# EAGLE design OutputIndicator_20_pins_v1p0 (EAGLE 9.6.2)
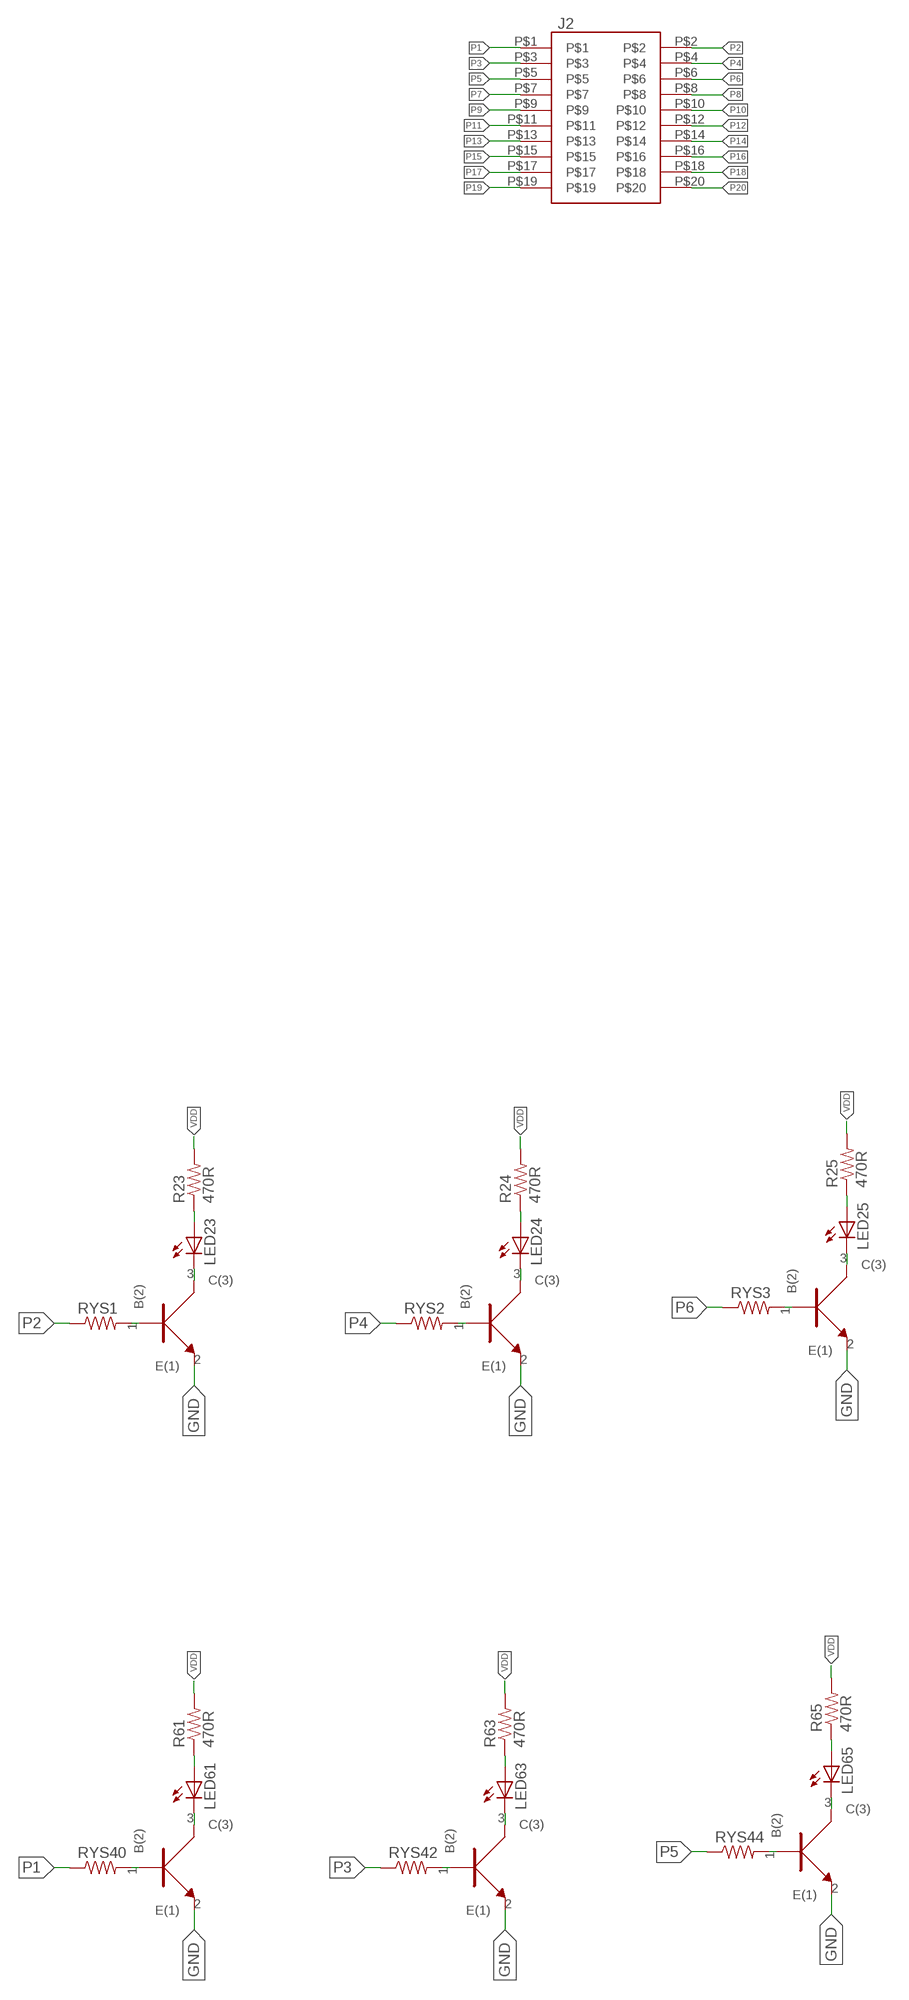
[diagram p0: schematic, sheet 1, part 1 of 2]
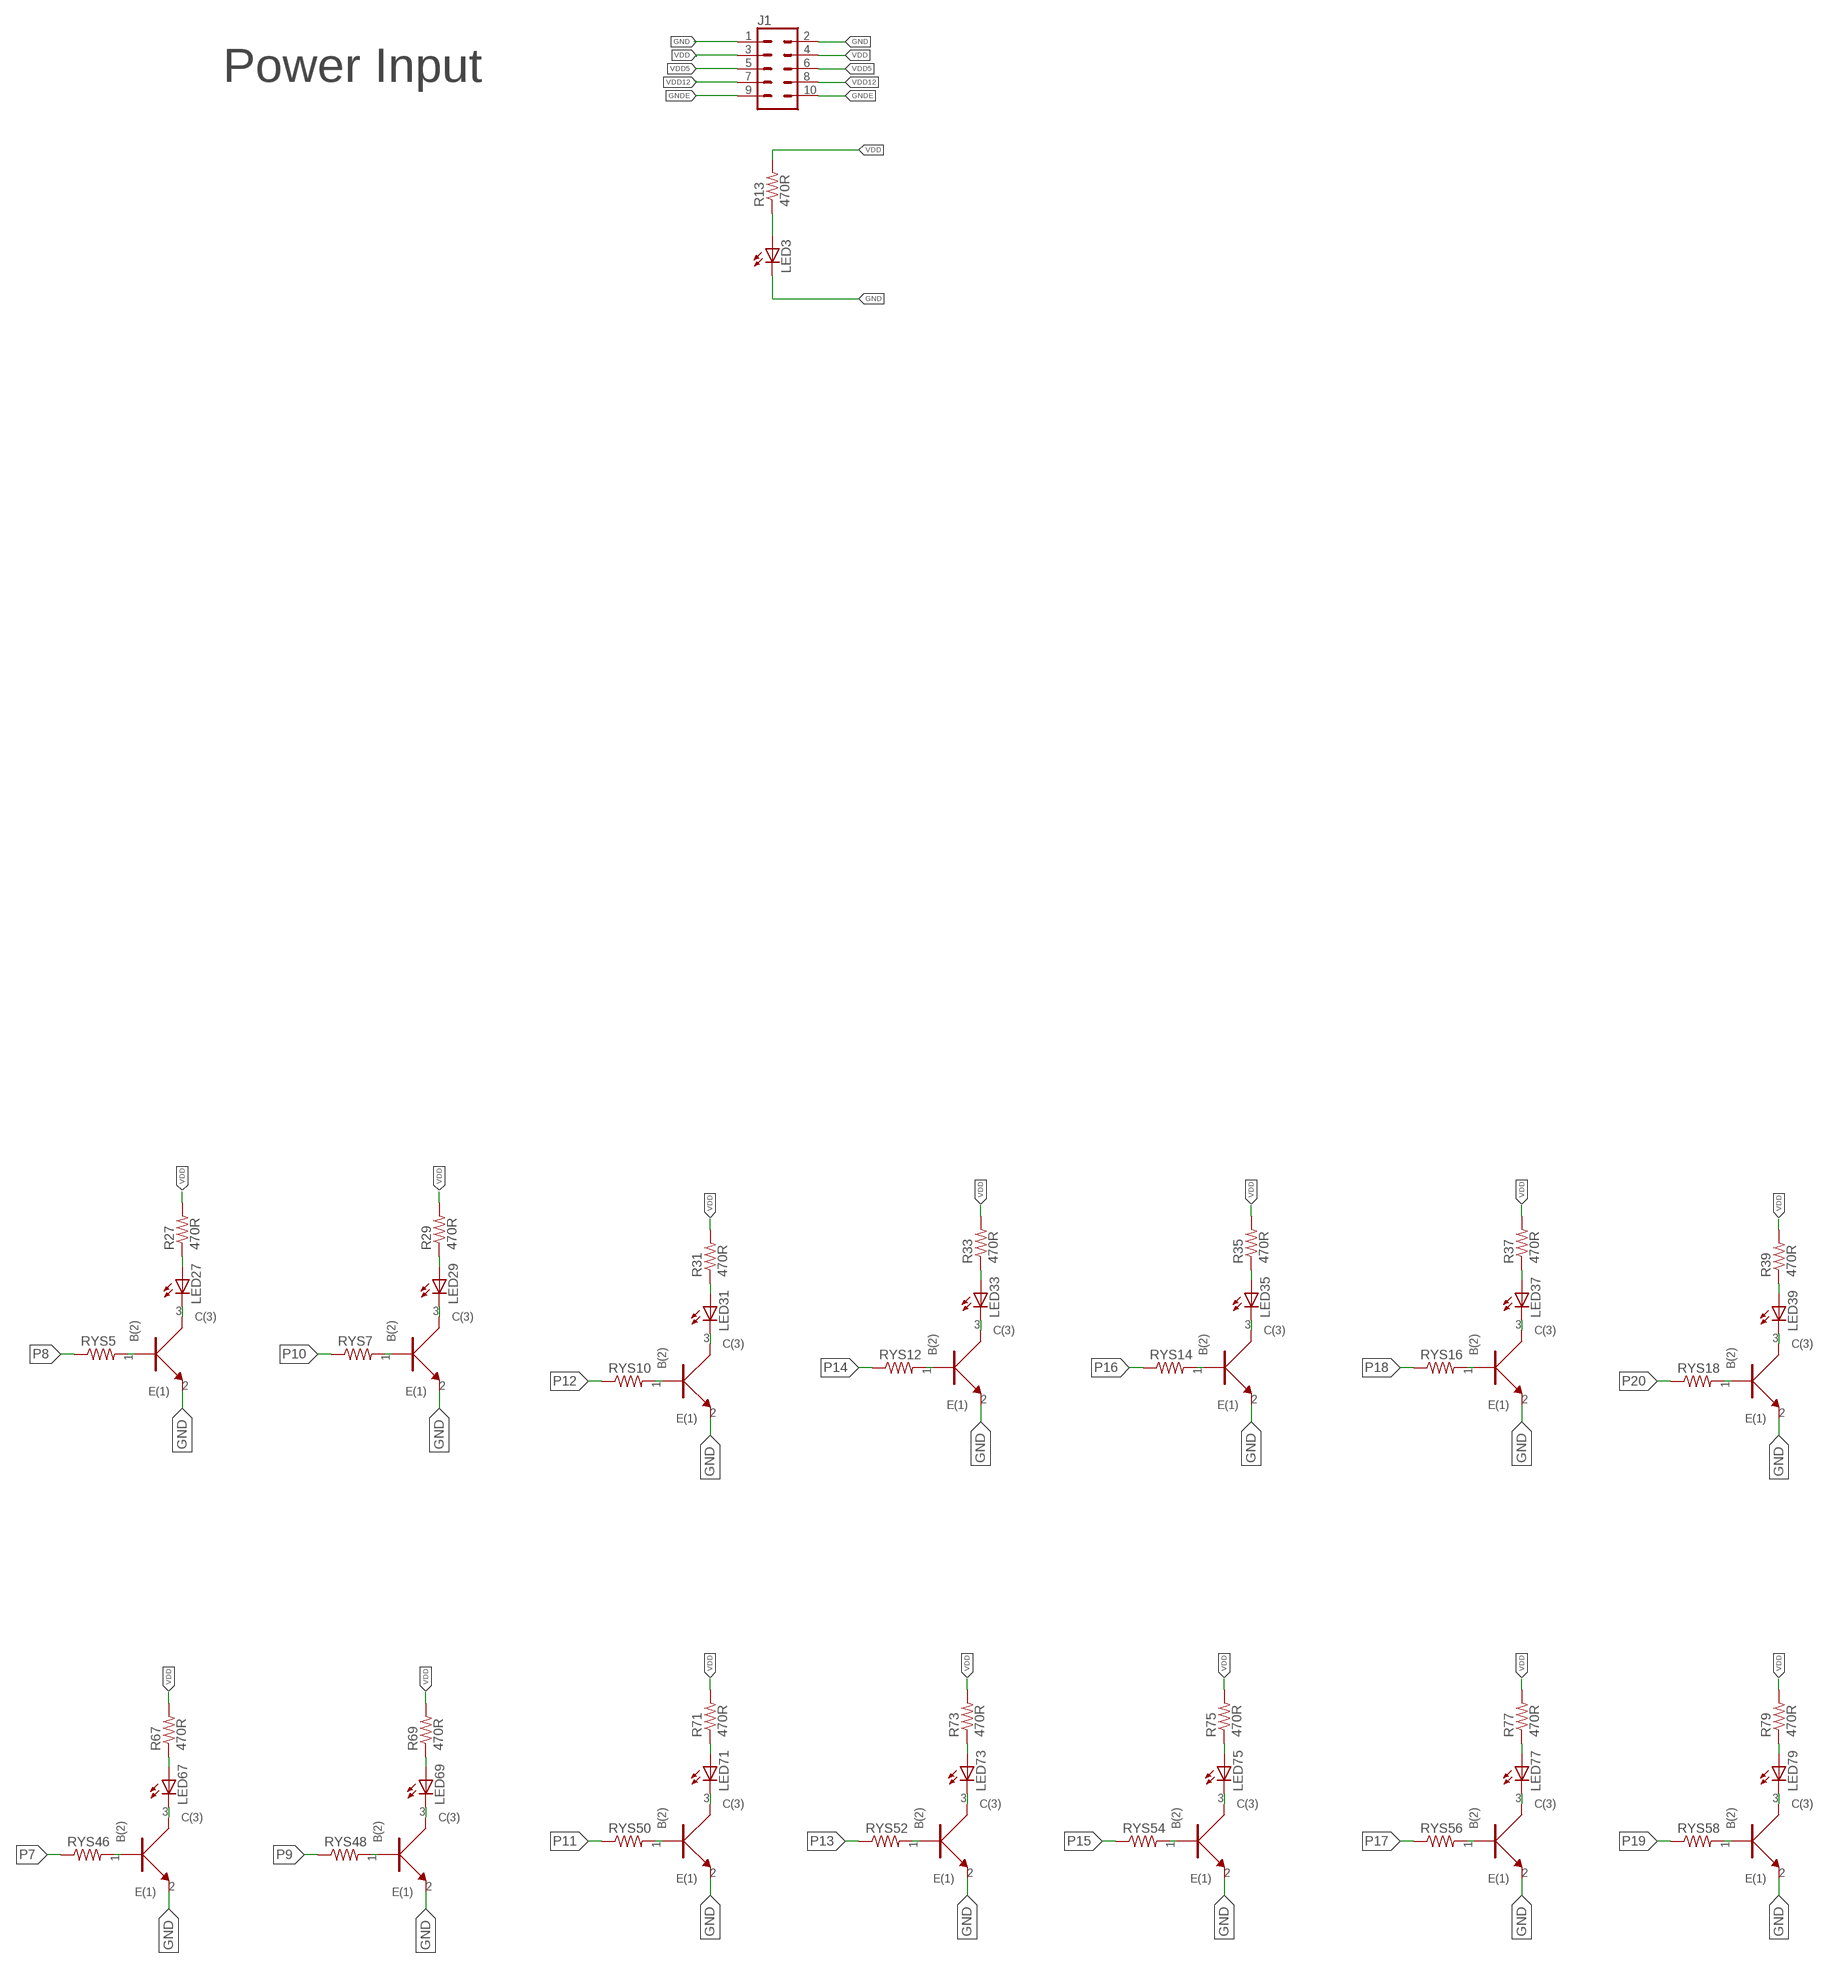
[diagram p1: schematic, sheet 1, part 2 of 2]

## Parts
J1  CONN_05X2PTH  [2X5]
J2  2_X_10_HEADER_GENERIC  [2_X_10_.1_INCH]
LED3  LED_0805_GREEN  [LED_0805_GREEN]
LED23  LED_0805_GREEN  [LED_0805_GREEN]
LED24  LED_0805_GREEN  [LED_0805_GREEN]
LED25  LED_0805_GREEN  [LED_0805_GREEN]
LED27  LED_0805_GREEN  [LED_0805_GREEN]
LED29  LED_0805_GREEN  [LED_0805_GREEN]
LED31  LED_0805_GREEN  [LED_0805_GREEN]
LED33  LED_0805_GREEN  [LED_0805_GREEN]
LED35  LED_0805_GREEN  [LED_0805_GREEN]
LED37  LED_0805_GREEN  [LED_0805_GREEN]
LED39  LED_0805_GREEN  [LED_0805_GREEN]
LED61  LED_0805_GREEN  [LED_0805_GREEN]
LED63  LED_0805_GREEN  [LED_0805_GREEN]
LED65  LED_0805_GREEN  [LED_0805_GREEN]
LED67  LED_0805_GREEN  [LED_0805_GREEN]
LED69  LED_0805_GREEN  [LED_0805_GREEN]
LED71  LED_0805_GREEN  [LED_0805_GREEN]
LED73  LED_0805_GREEN  [LED_0805_GREEN]
LED75  LED_0805_GREEN  [LED_0805_GREEN]
LED77  LED_0805_GREEN  [LED_0805_GREEN]
LED79  LED_0805_GREEN  [LED_0805_GREEN]
R13  470R  R_0402  [0402]
R23  470R  R_0402  [0402]
R24  470R  R_0402  [0402]
R25  470R  R_0402  [0402]
R27  470R  R_0402  [0402]
R29  470R  R_0402  [0402]
R31  470R  R_0402  [0402]
R33  470R  R_0402  [0402]
R35  470R  R_0402  [0402]
R37  470R  R_0402  [0402]
R39  470R  R_0402  [0402]
R61  470R  R_0402  [0402]
R63  470R  R_0402  [0402]
R65  470R  R_0402  [0402]
R67  470R  R_0402  [0402]
R69  470R  R_0402  [0402]
R71  470R  R_0402  [0402]
R73  470R  R_0402  [0402]
R75  470R  R_0402  [0402]
R77  470R  R_0402  [0402]
R79  470R  R_0402  [0402]
RYS1  1K  R_0402  [0402]
RYS2  1K  R_0402  [0402]
RYS3  1K  R_0402  [0402]
RYS5  1K  R_0402  [0402]
RYS7  1K  R_0402  [0402]
RYS10  1K  R_0402  [0402]
RYS12  1K  R_0402  [0402]
RYS14  1K  R_0402  [0402]
RYS16  1K  R_0402  [0402]
RYS18  1K  R_0402  [0402]
RYS40  1K  R_0402  [0402]
RYS42  1K  R_0402  [0402]
RYS44  1K  R_0402  [0402]
RYS46  1K  R_0402  [0402]
RYS48  1K  R_0402  [0402]
RYS50  1K  R_0402  [0402]
RYS52  1K  R_0402  [0402]
RYS54  1K  R_0402  [0402]
RYS56  1K  R_0402  [0402]
RYS58  1K  R_0402  [0402]
U1  BC846BW  [SOT323]
U2  BC846BW  [SOT323]
U3  BC846BW  [SOT323]
U5  BC846BW  [SOT323]
U7  BC846BW  [SOT323]
U9  BC846BW  [SOT323]
U11  BC846BW  [SOT323]
U13  BC846BW  [SOT323]
U15  BC846BW  [SOT323]
U17  BC846BW  [SOT323]
U40  BC846BW  [SOT323]
U42  BC846BW  [SOT323]
U44  BC846BW  [SOT323]
U46  BC846BW  [SOT323]
U48  BC846BW  [SOT323]
U50  BC846BW  [SOT323]
U52  BC846BW  [SOT323]
U54  BC846BW  [SOT323]
U56  BC846BW  [SOT323]
U58  BC846BW  [SOT323]

## Nets
GND: J1.1 J1.2 LED3.C U1.2(E(1)) U2.2(E(1)) U3.2(E(1)) U5.2(E(1)) U7.2(E(1)) U9.2(E(1)) U11.2(E(1)) U13.2(E(1)) U15.2(E(1)) U17.2(E(1)) U40.2(E(1)) U42.2(E(1)) U44.2(E(1)) U46.2(E(1)) U48.2(E(1)) U50.2(E(1)) U52.2(E(1)) U54.2(E(1)) U56.2(E(1)) U58.2(E(1))
GNDE: J1.9 J1.10
N$3: LED3.A R13.P$1
N$45: RYS1.P$2 U1.1(B(2))
N$46: LED23.A R23.P$1
N$47: LED23.C U1.3(C(3))
N$48: RYS2.P$2 U2.1(B(2))
N$49: LED24.A R24.P$1
N$50: LED24.C U2.3(C(3))
N$51: RYS3.P$2 U3.1(B(2))
N$52: LED25.A R25.P$1
N$53: LED25.C U3.3(C(3))
N$57: RYS5.P$2 U5.1(B(2))
N$58: LED27.A R27.P$1
N$59: LED27.C U5.3(C(3))
N$63: RYS7.P$2 U7.1(B(2))
N$64: LED29.A R29.P$1
N$65: LED29.C U7.3(C(3))
N$69: RYS10.P$2 U9.1(B(2))
N$70: LED31.A R31.P$1
N$71: LED31.C U9.3(C(3))
N$75: RYS12.P$2 U11.1(B(2))
N$76: LED33.A R33.P$1
N$77: LED33.C U11.3(C(3))
N$81: RYS14.P$2 U13.1(B(2))
N$82: LED35.A R35.P$1
N$83: LED35.C U13.3(C(3))
N$87: RYS16.P$2 U15.1(B(2))
N$88: LED37.A R37.P$1
N$89: LED37.C U15.3(C(3))
N$93: RYS18.P$2 U17.1(B(2))
N$94: LED39.A R39.P$1
N$95: LED39.C U17.3(C(3))
N$159: RYS40.P$2 U40.1(B(2))
N$160: LED61.A R61.P$1
N$161: LED61.C U40.3(C(3))
N$165: RYS42.P$2 U42.1(B(2))
N$166: LED63.A R63.P$1
N$167: LED63.C U42.3(C(3))
N$171: RYS44.P$2 U44.1(B(2))
N$172: LED65.A R65.P$1
N$173: LED65.C U44.3(C(3))
N$177: RYS46.P$2 U46.1(B(2))
N$178: LED67.A R67.P$1
N$179: LED67.C U46.3(C(3))
N$183: RYS48.P$2 U48.1(B(2))
N$184: LED69.A R69.P$1
N$185: LED69.C U48.3(C(3))
N$189: RYS50.P$2 U50.1(B(2))
N$190: LED71.A R71.P$1
N$191: LED71.C U50.3(C(3))
N$195: RYS52.P$2 U52.1(B(2))
N$196: LED73.A R73.P$1
N$197: LED73.C U52.3(C(3))
N$201: RYS54.P$2 U54.1(B(2))
N$202: LED75.A R75.P$1
N$203: LED75.C U54.3(C(3))
N$207: RYS56.P$2 U56.1(B(2))
N$208: LED77.A R77.P$1
N$209: LED77.C U56.3(C(3))
N$213: RYS58.P$2 U58.1(B(2))
N$214: LED79.A R79.P$1
N$215: LED79.C U58.3(C(3))
P1: J2.P$1 RYS40.P$1
P2: J2.P$2 RYS1.P$1
P3: J2.P$3 RYS42.P$1
P4: J2.P$4 RYS2.P$1
P5: J2.P$5 RYS44.P$1
P6: J2.P$6 RYS3.P$1
P7: J2.P$7 RYS46.P$1
P8: J2.P$8 RYS5.P$1
P9: J2.P$9 RYS48.P$1
P10: J2.P$10 RYS7.P$1
P11: J2.P$11 RYS50.P$1
P12: J2.P$12 RYS10.P$1
P13: J2.P$13 RYS52.P$1
P14: J2.P$14 RYS12.P$1
P15: J2.P$15 RYS54.P$1
P16: J2.P$16 RYS14.P$1
P17: J2.P$17 RYS56.P$1
P18: J2.P$18 RYS16.P$1
P19: J2.P$19 RYS58.P$1
P20: J2.P$20 RYS18.P$1
VDD: J1.3 J1.4 R13.P$2 R23.P$2 R24.P$2 R25.P$2 R27.P$2 R29.P$2 R31.P$2 R33.P$2 R35.P$2 R37.P$2 R39.P$2 R61.P$2 R63.P$2 R65.P$2 R67.P$2 R69.P$2 R71.P$2 R73.P$2 R75.P$2 R77.P$2 R79.P$2
VDD5: J1.5 J1.6
VDD12: J1.7 J1.8

## Notes on the sheet
- Power Input

## Library data of the parts
J1 = 3D_MIG_Controller:CONN_05X2: Multi connection point. Often used as Generic Header-pin footprint for 0.1 inch spaced/style header connections For AVR SPI programming port, see special device with nice symbol: "AVR_SPI_PROG_5x2.dev" You can populate with any combo of single row headers, but if you'd like an exact match, check these: 2x5 AVR ICSP Male Header <https://www.sparkfun.com/products/778> (PRT-00778) 2x5 Pin Shrouded Header <https://www.sparkfun.com/products/8506> (PRT-08506) On any of the 0.1 inch spaced packages, you can populate with these: Break Away Headers - Straight <https://www.sparkfun.com/products/116> (PRT-00116) Break Away Male Headers - Right Angle <https://www.sparkfun.com/products/553> (PRT-00553) Female Headers <https://www.sparkfun.com/products/115> (PRT-00115) Break Away Headers - Machine Pin <https://www.sparkfun.com/products/117> (PRT-00117) Break Away Female Headers - Swiss Machine Pin <https://www.sparkfun.com/products/743> (PRT-00743) Special note: the shrouded connector mates well with our 5x2 ribbon cables: 2x5 Pin IDC Ribbon Cable <https://www.sparkfun.com/products/8535> (PRT-08535); PROD_ID: CONN-08499; SF_ID: PRT-0778
J2 = 3D_MIG_Controller:2_X_10_HEADER_GENERIC: CONN HEADER R/A 20POS 2.54MM, Straight, Right Angle; PARTNO: 67996-420HLF
LED3 LED23-LED25 LED27 LED29 LED31 LED33 LED35 LED37 LED39 LED61 LED63 LED65 LED67 LED69 LED71 LED73 LED75 LED77 LED79 = 3D_MIG_Controller:LED_0805_GREEN
R13 R23-R25 R27 R29 R31 R33 R35 R37 R39 R61 R63 R65 R67 R69 R71 R73 R75 R77 R79 RYS1-RYS3 RYS5 RYS7 RYS10 RYS12 RYS14 RYS16 RYS18 RYS40 RYS42 RYS44 RYS46 RYS48 RYS50 RYS52 RYS54 RYS56 RYS58 = 3D_MIG_Controller:R_0402
U1-U3 U5 U7 U9 U11 U13 U15 U17 U40 U42 U44 U46 U48 U50 U52 U54 U56 U58 = 3D_MIG_Controller:BC846BW; MANUFACTURER_PART_NUMBER: BC846BW; VENDOR: Nexperia

## Board
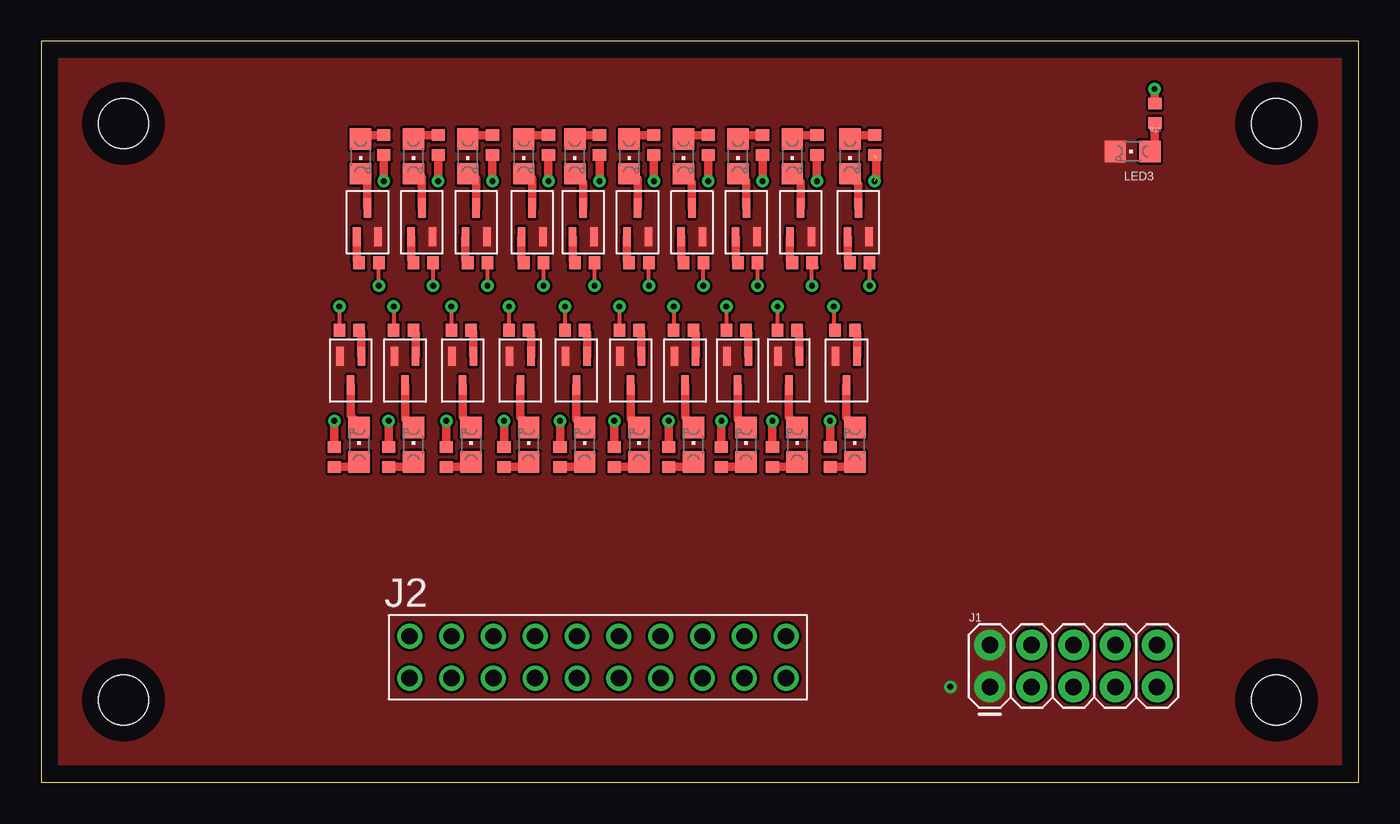
[diagram p2: board, top side]
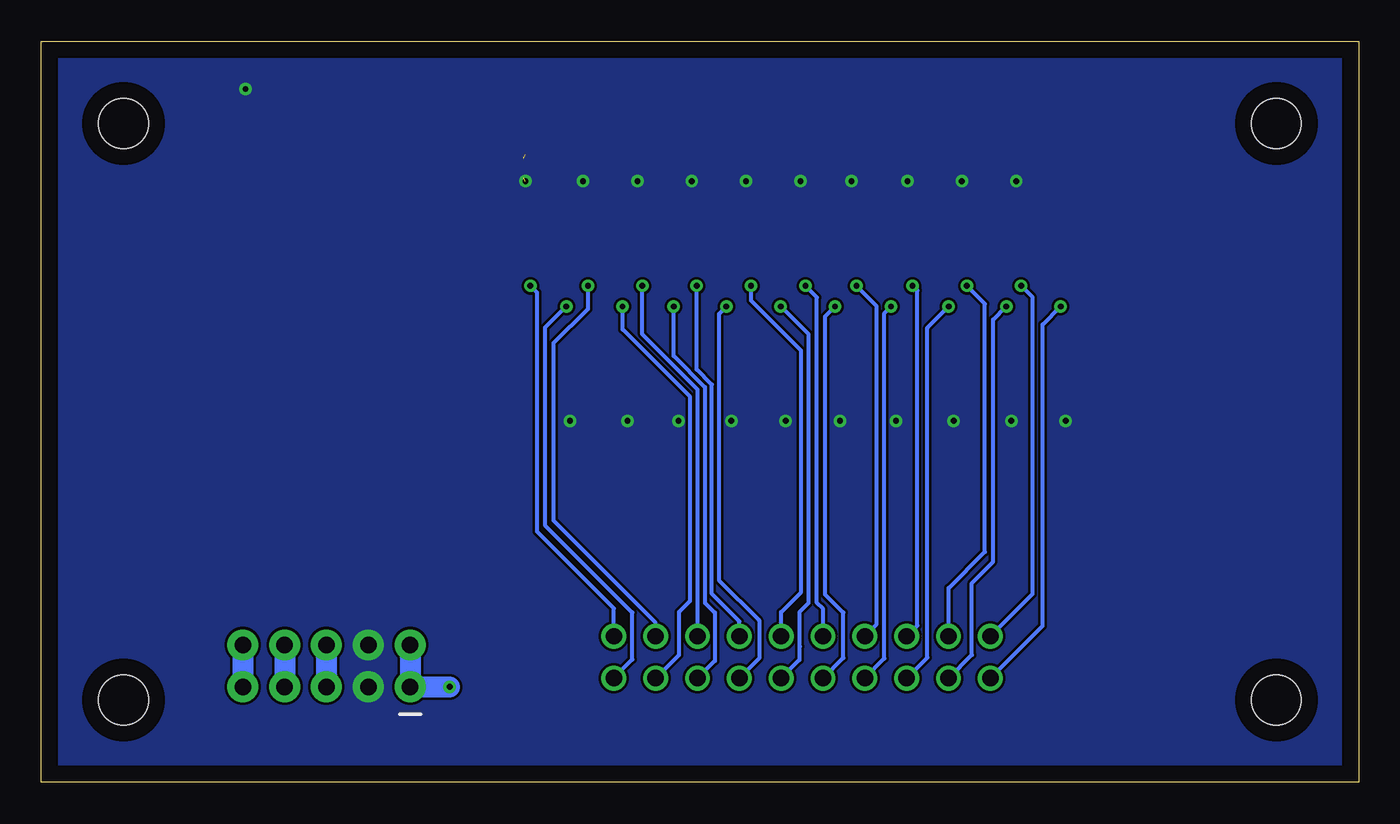
[diagram p3: board, bottom side, seen from below]

Size 80 x 45 mm. Coordinates in mm from the lower left corner, seen from the top.
Outline: 0,0 80,0 80,45 0,45 0,0
Copper layers (1*16): Top 0.035mm / dielectric 1.5mm / Bottom 0.035mm
Design rules "default": minimum track width 6mil, minimum drill 0.35mm, track to track 6mil, track to pad 6mil, pad to pad 6mil, via to via 6mil, smd to smd 6mil, copper to edge 40mil, drill to drill 6mil, minimum pad ring 10mil, minimum via ring 8mil, stop-mask expansion 4mil, vias tented up to drill 0mil, thermal gap 10mil
Holes 3 mm at 5,5 75,5 5,40 75,40

### Footprints (pad centres in the part's own frame; a part is rotated, then mirrored left to right if it is on the bottom)
2X5 = drill 1 pad 1.88: 1 0,0; 2 0,2.54; 3 2.54,0; 4 2.54,2.54; 5 5.08,0; 6 5.08,2.54; 7 7.62,0; 8 7.62,2.54; 9 10.16,0; 10 10.16,2.54
2_X_10_.1_INCH = drill 1: P$1 -11.43,-1.27; P$2 -11.43,1.27; P$3 -8.89,-1.27; P$4 -8.89,1.27; P$5 -6.35,-1.27; P$6 -6.35,1.27; P$7 -3.81,-1.27; P$8 -3.81,1.27; P$9 -1.27,-1.27; P$10 -1.27,1.27; P$11 1.27,-1.27; P$12 1.27,1.27; P$13 3.81,-1.27; P$14 3.81,1.27; P$15 6.35,-1.27; P$16 6.35,1.27; P$17 8.89,-1.27; P$18 8.89,1.27; P$19 11.43,-1.27; P$20 11.43,1.27
LED_0805_GREEN = smd 1.3 x 1.3: A 0,-1.05; C 0,1.05
0402 = smd 0.8 x 0.7: P$1 0,0.6; P$2 0,-0.6
SOT323 = smd 0.457 x 1.168: 1 -0.65,-0.876; 2 0.65,-0.876; 3 0,0.876

### Placement (x,y rotation side)
J1  57.6,5.8 0 top
J2  33.8,7.6 0 top
LED3  66.26,38.31 90 top
LED23  19.4,38 180 top
LED24  22.6,38 180 top
LED25  25.9,38 180 top
LED27  29.3,38 180 top
LED29  32.4,38 180 top
LED31  35.7,38 180 top
LED33  39,38 180 top
LED35  42.3,38 180 top
LED37  45.6,38 180 top
LED39  49.1,38 180 top
LED61  19.3,20.5 0 top
LED63  22.6,20.5 0 top
LED65  26.1,20.5 0 top
LED67  29.6,20.5 0 top
LED69  33,20.5 0 top
LED71  36.3,20.5 0 top
LED73  39.6,20.5 0 top
LED75  42.8,20.5 0 top
LED77  45.9,20.5 0 top
LED79  49.4,20.5 0 top
R13  67.62,40.63 180 top
R23  20.8,38.7 0 top
R24  24.1,38.7 0 top
R25  27.4,38.7 0 top
R27  30.8,38.7 0 top
R29  33.9,38.7 0 top
R31  37.2,38.7 0 top
R33  40.5,38.7 0 top
R35  43.8,38.7 0 top
R37  47.1,38.7 0 top
R39  50.6,38.7 0 top
R61  17.8,19.75 180 top
R63  21.1,19.75 180 top
R65  24.6,19.75 180 top
R67  28.1,19.75 180 top
R69  31.5,19.75 180 top
R71  34.8,19.75 180 top
R73  38.1,19.75 180 top
R75  41.3,19.75 180 top
R77  44.4,19.75 180 top
R79  47.9,19.75 180 top
RYS1  19.9,31.55 270 top
RYS2  23.2,31.55 270 top
RYS3  26.5,31.55 270 top
RYS5  29.9,31.55 270 top
RYS7  33,31.55 270 top
RYS10  36.3,31.55 270 top
RYS12  39.6,31.55 270 top
RYS14  42.9,31.55 270 top
RYS16  46.2,31.55 270 top
RYS18  49.7,31.55 270 top
RYS40  18.7,27.45 90 top
RYS42  22,27.45 90 top
RYS44  25.5,27.45 90 top
RYS46  29,27.45 90 top
RYS48  32.4,27.45 90 top
RYS50  35.7,27.45 90 top
RYS52  39,27.45 90 top
RYS54  42.2,27.45 90 top
RYS56  45.3,27.45 90 top
RYS58  48.8,27.45 90 top
U1  19.81,34 0 top
U2  23.11,34 0 top
U3  26.41,34 0 top
U5  29.81,34 0 top
U7  32.91,34 0 top
U9  36.21,34 0 top
U11  39.51,34 0 top
U13  42.81,34 0 top
U15  46.11,34 0 top
U17  49.61,34 0 top
U40  18.79,25 180 top
U42  22.09,25 180 top
U44  25.59,25 180 top
U46  29.09,25 180 top
U48  32.49,25 180 top
U50  35.79,25 180 top
U52  39.09,25 180 top
U54  42.29,25 180 top
U56  45.39,25 180 top
U58  48.89,25 180 top

### Tracks (layer width: path | path; a pad name or v marks a point on that pad's centre or on a via)
GND  (via drill 0.35)
  Bottom 1.27: J1.2 J1.1 v55.2,5.8
  pour Top (no thermals): 0,0 0,45 80,45 80,0
GNDE
  Bottom 1.27: J1.10 J1.9
N$3
  Top 0.508: R13.P$1 67.62,38.42 LED3.A
N$45
  Top 0.254: 19.16,31.51 RYS1.P$2
  Top 0.508: U1.1 19.16,31.69 RYS1.P$2
N$46
  Top 0.152: R23.P$1 20.56,39.45
  Top 0.508: R23.P$1 19.84,39.3 LED23.A
N$47
  Top 0.254: LED23.C 19.38,37.17 19.38,37.27
  Top 0.508: U1.3 19.81,36.84 19.38,37.27
N$48
  Top 0.254: 22.46,31.51 RYS2.P$2
  Top 0.508: U2.1 22.46,31.69 RYS2.P$2
N$49
  Top 0.152: R24.P$1 23.86,39.35
  Top 0.508: R24.P$1 22.84,39.3 LED24.A
N$50
  Top 0.254: 22.68,37.17 LED24.C
  Top 0.508: U2.3 23.11,36.74 22.68,37.17
N$51
  Top 0.254: 25.76,31.51 RYS3.P$2
  Top 0.508: U3.1 25.76,31.69 RYS3.P$2
N$52
  Top 0.152: R25.P$1 27.16,39.25
  Top 0.508: R25.P$1 26.14,39.3 LED25.A
N$53
  Top 0.254: 25.98,37.08 LED25.C
  Top 0.508: U3.3 26.41,36.64 25.98,37.08
N$57
  Top 0.254: 29.16,31.51 RYS5.P$2
  Top 0.508: U5.1 29.16,31.69 RYS5.P$2
N$58
  Top 0.152: R27.P$1 30.56,39.25
  Top 0.508: R27.P$1 29.54,39.3 LED27.A
N$59
  Top 0.254: 29.38,37.08 LED27.C
  Top 0.508: U5.3 29.81,36.64 29.38,37.08
N$63
  Top 0.254: 32.26,31.51 RYS7.P$2
  Top 0.508: U7.1 32.26,31.69 RYS7.P$2
N$64
  Top 0.152: R29.P$1 33.66,39.05
  Top 0.508: R29.P$1 32.64,39.3 LED29.A
N$65
  Top 0.254: 32.48,36.88 LED29.C
  Top 0.508: U7.3 32.91,36.44 32.48,36.88
N$69
  Top 0.254: 35.56,31.51 RYS10.P$2
  Top 0.508: U9.1 35.56,31.69 RYS10.P$2
N$70
  Top 0.152: R31.P$1 36.96,39.25
  Top 0.508: R31.P$1 35.94,39.3 LED31.A
N$71
  Top 0.254: 35.77,37.08 LED31.C
  Top 0.508: U9.3 36.21,36.64 35.77,37.08
N$75
  Top 0.254: 38.86,31.51 RYS12.P$2
  Top 0.508: U11.1 38.86,31.69 RYS12.P$2
N$76
  Top 0.152: R33.P$1 40.26,39.05
  Top 0.508: R33.P$1 39.24,39.3 LED33.A
N$77
  Top 0.254: 39.08,36.88 LED33.C
  Top 0.508: U11.3 39.51,36.44 39.08,36.88
N$81
  Top 0.254: 42.16,31.51 RYS14.P$2
  Top 0.508: U13.1 42.16,31.69 RYS14.P$2
N$82
  Top 0.152: R35.P$1 43.56,39.15
  Top 0.508: R35.P$1 42.54,39.3 LED35.A
N$83
  Top 0.254: 42.38,36.98 LED35.C
  Top 0.508: U13.3 42.81,36.54 42.38,36.98
N$87
  Top 0.254: 45.46,31.51 RYS16.P$2
  Top 0.508: U15.1 45.46,31.69 RYS16.P$2
N$88
  Top 0.152: R37.P$1 46.86,39.05
  Top 0.508: R37.P$1 45.84,39.3 LED37.A
N$89
  Top 0.254: 45.67,36.88 LED37.C
  Top 0.508: U15.3 46.11,36.44 45.67,36.88
N$93
  Top 0.254: 48.96,31.51 RYS18.P$2
  Top 0.508: U17.1 48.96,31.69 RYS18.P$2
N$94
  Top 0.508: R39.P$1 49.34,39.3 LED39.A
N$95
  Top 0.254: 49.17,36.77 LED39.C
  Top 0.508: U17.3 49.61,36.34 49.17,36.77
N$159
  Top 0.254: 19.44,27.49 RYS40.P$2
  Top 0.508: U40.1 19.44,27.31 RYS40.P$2
N$160
  Top 0.152: R61.P$1 18.04,19.39
  Top 0.508: LED61.A 19,19.15 R61.P$1
N$161
  Top 0.254: LED61.C 19.32,21.57 19.32,21.73
  Top 0.508: U40.3 18.79,22.26 19.32,21.73
N$165
  Top 0.254: 22.74,27.49 RYS42.P$2
  Top 0.508: U42.1 22.74,27.31 RYS42.P$2
N$166
  Top 0.152: R63.P$1 21.34,19.39
  Top 0.508: R63.P$1 22.3,19.15 LED63.A
N$167
  Top 0.254: 22.52,21.62 LED63.C
  Top 0.508: U42.3 22.09,22.06 22.52,21.62
N$171
  Top 0.254: 26.24,27.49 RYS44.P$2
  Top 0.508: U44.1 26.24,27.31 RYS44.P$2
N$172
  Top 0.152: R65.P$1 24.84,19.39
  Top 0.508: R65.P$1 25.8,19.15 LED65.A
N$173
  Top 0.254: 26.02,21.73 26.02,21.62 LED65.C
  Top 0.508: U44.3 25.59,22.16 26.02,21.73
N$177
  Top 0.254: 29.74,27.49 RYS46.P$2
  Top 0.508: U46.1 29.74,27.31 RYS46.P$2
N$178
  Top 0.152: R67.P$1 28.34,19.39
  Top 0.508: R67.P$1 29.3,19.15 LED67.A
N$179
  Top 0.254: 29.52,21.73 29.52,21.62 LED67.C
  Top 0.508: U46.3 29.09,22.16 29.52,21.73
N$183
  Top 0.254: 33.14,27.49 RYS48.P$2
  Top 0.508: U48.1 33.14,27.31 RYS48.P$2
N$184
  Top 0.152: R69.P$1 31.74,19.39
  Top 0.508: R69.P$1 32.7,19.15 LED69.A
N$185
  Top 0.254: 32.92,21.62 LED69.C
  Top 0.508: U48.3 32.49,22.06 32.92,21.62
N$189
  Top 0.254: 36.44,27.49 RYS50.P$2
  Top 0.508: U50.1 36.44,27.31 RYS50.P$2
N$190
  Top 0.152: R71.P$1 35.04,19.39
  Top 0.508: R71.P$1 36,19.15 LED71.A
N$191
  Top 0.254: 36.23,21.62 LED71.C
  Top 0.508: U50.3 35.79,22.06 36.23,21.62
N$195
  Top 0.254: 39.74,27.49 RYS52.P$2
  Top 0.508: U52.1 39.74,27.31 RYS52.P$2
N$196
  Top 0.152: R73.P$1 38.34,19.39
  Top 0.508: R73.P$1 39.3,19.15 LED73.A
N$197
  Top 0.254: 39.52,21.73 39.52,21.62 LED73.C
  Top 0.508: U52.3 39.09,22.16 39.52,21.73
N$201
  Top 0.254: 42.94,27.49 RYS54.P$2
  Top 0.508: U54.1 42.94,27.31 RYS54.P$2
N$202
  Top 0.152: R75.P$1 41.54,19.39
  Top 0.508: R75.P$1 42.5,19.15 LED75.A
N$203
  Top 0.254: 42.73,21.62 LED75.C
  Top 0.508: U54.3 42.29,22.06 42.73,21.62
N$207
  Top 0.254: 46.04,27.49 RYS56.P$2
  Top 0.508: U56.1 46.04,27.31 RYS56.P$2
N$208
  Top 0.152: R77.P$1 44.64,19.39
  Top 0.508: R77.P$1 45.6,19.15 LED77.A
N$209
  Top 0.254: 45.83,21.73 45.83,21.62 LED77.C
  Top 0.508: U56.3 45.39,22.16 45.83,21.73
N$213
  Top 0.254: 49.54,27.49 RYS58.P$2
  Top 0.508: U58.1 49.54,27.31 RYS58.P$2
N$214
  Top 0.152: R79.P$1 48.14,19.39
  Top 0.508: R79.P$1 49.1,19.15 LED79.A
N$215
  Top 0.254: 49.33,21.73 49.33,21.62 LED79.C
  Top 0.508: U58.3 48.89,22.16 49.33,21.73
P1  (via drill 0.35)
  Top 0.254: v18.1,28.89 RYS40.P$1
  Bottom 0.254: J2.P$1 19.2,9.5 19.2,27.79 v18.1,28.89
P2  (via drill 0.35)
  Top 0.254: v20.5,30.15 RYS1.P$1
  Bottom 0.254: J2.P$2 19.8,11.44 19.8,29.45 v20.5,30.15
P3  (via drill 0.35)
  Top 0.254: v21.4,28.89 RYS42.P$1
  Bottom 0.254: J2.P$3 23.5,7.74 23.5,12.1 22.2,13.4 22.2,28.09 v21.4,28.89
P4  (via drill 0.35)
  Top 0.254: v23.8,30.15 RYS2.P$1
  Bottom 0.254: J2.P$4 24.91,11.79 22.7,14 22.7,29.05 v23.8,30.15
P5  (via drill 0.35)
  Top 0.254: v24.9,28.89 RYS44.P$1
  Bottom 0.254: J2.P$5 26.2,7.58 26.2,27.59 v24.9,28.89
P6  (via drill 0.35)
  Top 0.254: v27.1,30.15 RYS3.P$1
  Bottom 0.254: J2.P$6 26.8,9.52 26.8,29.85 v27.1,30.15
P7  (via drill 0.35)
  Top 0.254: v28.4,28.89 RYS46.P$1
  Bottom 0.254: J2.P$7 28.8,7.52 28.8,28.49 v28.4,28.89
P8  (via drill 0.35)
  Top 0.254: v30.5,30.15 RYS5.P$1
  Bottom 0.254: v30.5,30.15 29.3,28.95 29.3,9.56 J2.P$8
P9  (via drill 0.35)
  Top 0.254: v31.8,28.89 RYS48.P$1
  Bottom 0.254: J2.P$9 31.3,7.56 31.3,10.3 32.4,11.4 32.4,28.29 v31.8,28.89
P10  (via drill 0.35)
  Top 0.254: v33.6,30.15 RYS7.P$1
  Bottom 0.254: J2.P$10 32.53,10.53 32.9,10.9 32.9,29.45 v33.6,30.15
P11  (via drill 0.35)
  Top 0.254: v35.1,28.89 RYS50.P$1
  Bottom 0.254: J2.P$11 33.97,7.43 33.97,8.21 33.94,8.24 33.94,10.36 33.4,10.9 33.4,27.19 v35.1,28.89
P12  (via drill 0.35)
  Top 0.254: v36.9,30.15 RYS10.P$1
  Bottom 0.254: J2.P$12 35.07,10.33 33.86,11.54 33.86,26.21 36.9,29.25 v36.9,30.15
P13  (via drill 0.35)
  Top 0.254: v38.4,28.89 RYS52.P$1
  Bottom 0.254: v38.4,28.89 38.86,28.43 38.86,12.28 36.41,9.83 36.41,7.53 J2.P$13
P14  (via drill 0.35)
  Top 0.254: v40.2,30.15 RYS12.P$1
  Bottom 0.254: J2.P$14 37.61,9.77 39.28,11.44 39.28,24.15 40.2,25.07 v40.2,30.15
P15  (via drill 0.35)
  Top 0.254: v41.6,28.89 RYS54.P$1
  Bottom 0.254: 41.85,28.89 v41.6,28.89 41.6,25.89 39.7,23.99 39.7,10.9 39.1,10.3 39.1,7.38 J2.P$15
P16  (via drill 0.35)
  Top 0.254: v43.5,30.15 RYS14.P$1
  Bottom 0.254: J2.P$16 40.15,23.85 43.5,27.2 v43.5,30.15
P17  (via drill 0.35)
  Top 0.254: v44.7,28.89 RYS56.P$1
  Bottom 0.254: J2.P$17 41.29,7.73 41.29,10.33 40.6,11.02 40.6,23.4 44.7,27.5 v44.7,28.89
P18  (via drill 0.35)
  Top 0.254: 47.09,31.26 RYS16.P$1 v46.8,30.15
  Bottom 0.254: J2.P$18 42.69,9.69 48.9,15.9 48.9,26.65 46.8,28.75 v46.8,30.15
P19  (via drill 0.35)
  Top 0.254: v48.12,28.89 48.12,27.54 RYS58.P$1
  Bottom 0.254: J2.P$19 44.1,7.46 44.1,10.3 49.41,15.62 49.41,27.59 v48.12,28.89
P20  (via drill 0.35)
  Top 0.254: v50.3,30.15 RYS18.P$1
  Bottom 0.254: J2.P$20 45.23,10.57 49.9,15.24 49.9,29.75 v50.3,30.15
VDD  (via drill 0.35)  (2 unrouted)
  Top 0.508: R23.P$2 v20.8,36.5 | R24.P$2 v24.1,36.5 | R25.P$2 v27.4,36.5 | R27.P$2 v30.8,36.5 | R29.P$2 v33.9,36.5 | R31.P$2 v37.2,36.5 | R33.P$2 v40.5,36.5 | R35.P$2 v43.8,36.5 | R37.P$2 v47.1,36.5 | 50.7,37.89 50.7,36.7 | R61.P$2 v17.8,21.95 | R63.P$2 v21.1,21.95 | R65.P$2 v24.6,21.95 | R67.P$2 v28.1,21.95 | R69.P$2 v31.5,21.95 | R71.P$2 v34.8,21.95 | R73.P$2 v38.1,21.95 | R75.P$2 v41.3,21.95 | R77.P$2 v44.4,21.95 | R79.P$2 v47.9,21.95 | R13.P$2 67.62,42.08 v67.6,42.1
  other vias: 50.6,36.5
  pour Bottom (no thermals): 0,0 0,45 80,45 80,0
VDD5
  Bottom 1.27: J1.6 J1.5
VDD12
  Bottom 1.27: J1.8 J1.7